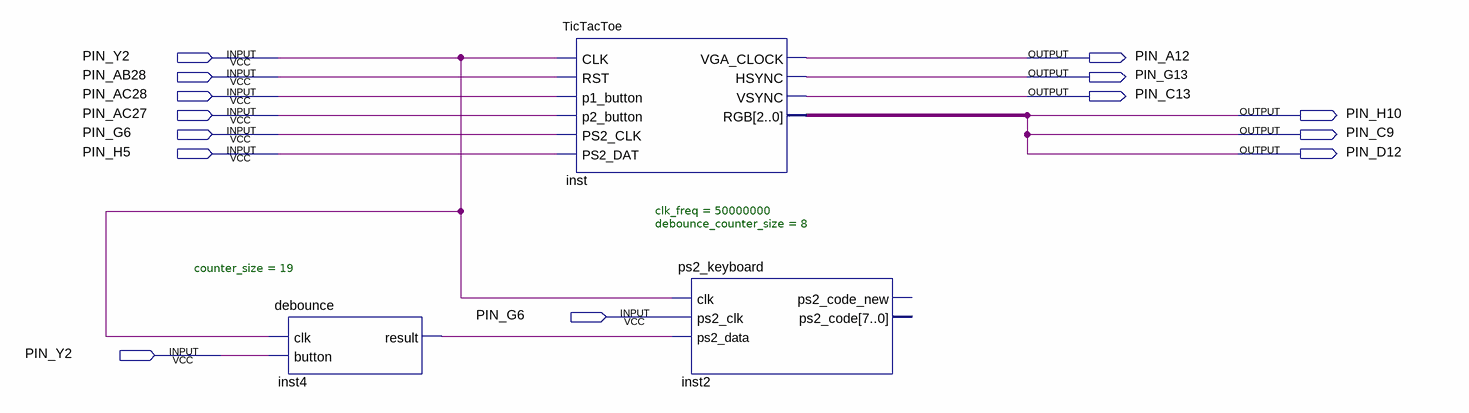
[diagram p0: schematic sheet]
// Quartus schematic Block1.bdf as structural Verilog: 3 symbols, 14 pins
module Block1 (
  input  PIN_Y2,
  input  PIN_AB28,
  input  PIN_AC28,
  input  PIN_AC27,
  input  PIN_G6,
  input  PIN_H5,
  output PIN_A12,
  output PIN_G13,
  output PIN_C13,
  output PIN_H10,
  output PIN_C9,
  output PIN_D12
);

  wire inst4_result;
  wire [2:0] inst_rgb;

  debounce #(.counter_size(19)) inst4 (.clk(PIN_Y2), .button(PIN_Y2), .result(inst4_result));
  TicTacToe inst (
    .CLK(PIN_Y2), .RST(PIN_AB28), .p1_button(PIN_AC28), .p2_button(PIN_AC27), .PS2_CLK(PIN_G6),
    .PS2_DAT(PIN_H5), .VGA_CLOCK(PIN_A12), .HSYNC(PIN_G13), .VSYNC(PIN_C13), .RGB(inst_rgb));
  ps2_keyboard #(.clk_freq(50000000), .debounce_counter_size(8)) inst2 (
    .clk(PIN_Y2), .ps2_clk(PIN_G6), .ps2_data(inst4_result));  // open: ps2_code_new, ps2_code

  assign PIN_D12 = PIN_C9;
endmodule
